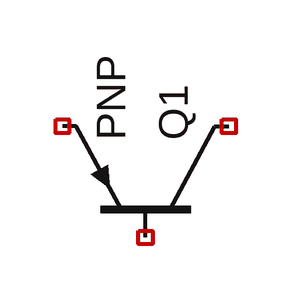
[diagram p0: schematic Draft1.asc]
Draft1.asc, the LTspice schematic file:
Version 4
SHEET 1 880 680
SYMBOL pnp 272 176 M270
SYMATTR InstName Q1

The netlist it stands for:
* Draft1.asc
Q1 NC_01 NC_02 NC_03 0 PNP
.model NPN NPN
.model PNP PNP
.lib standard.bjt
.backanno
.end